# Altium schematic sheet Schematic.SchDoc
size A3; SheetNumber: 1; SheetTotal: 2
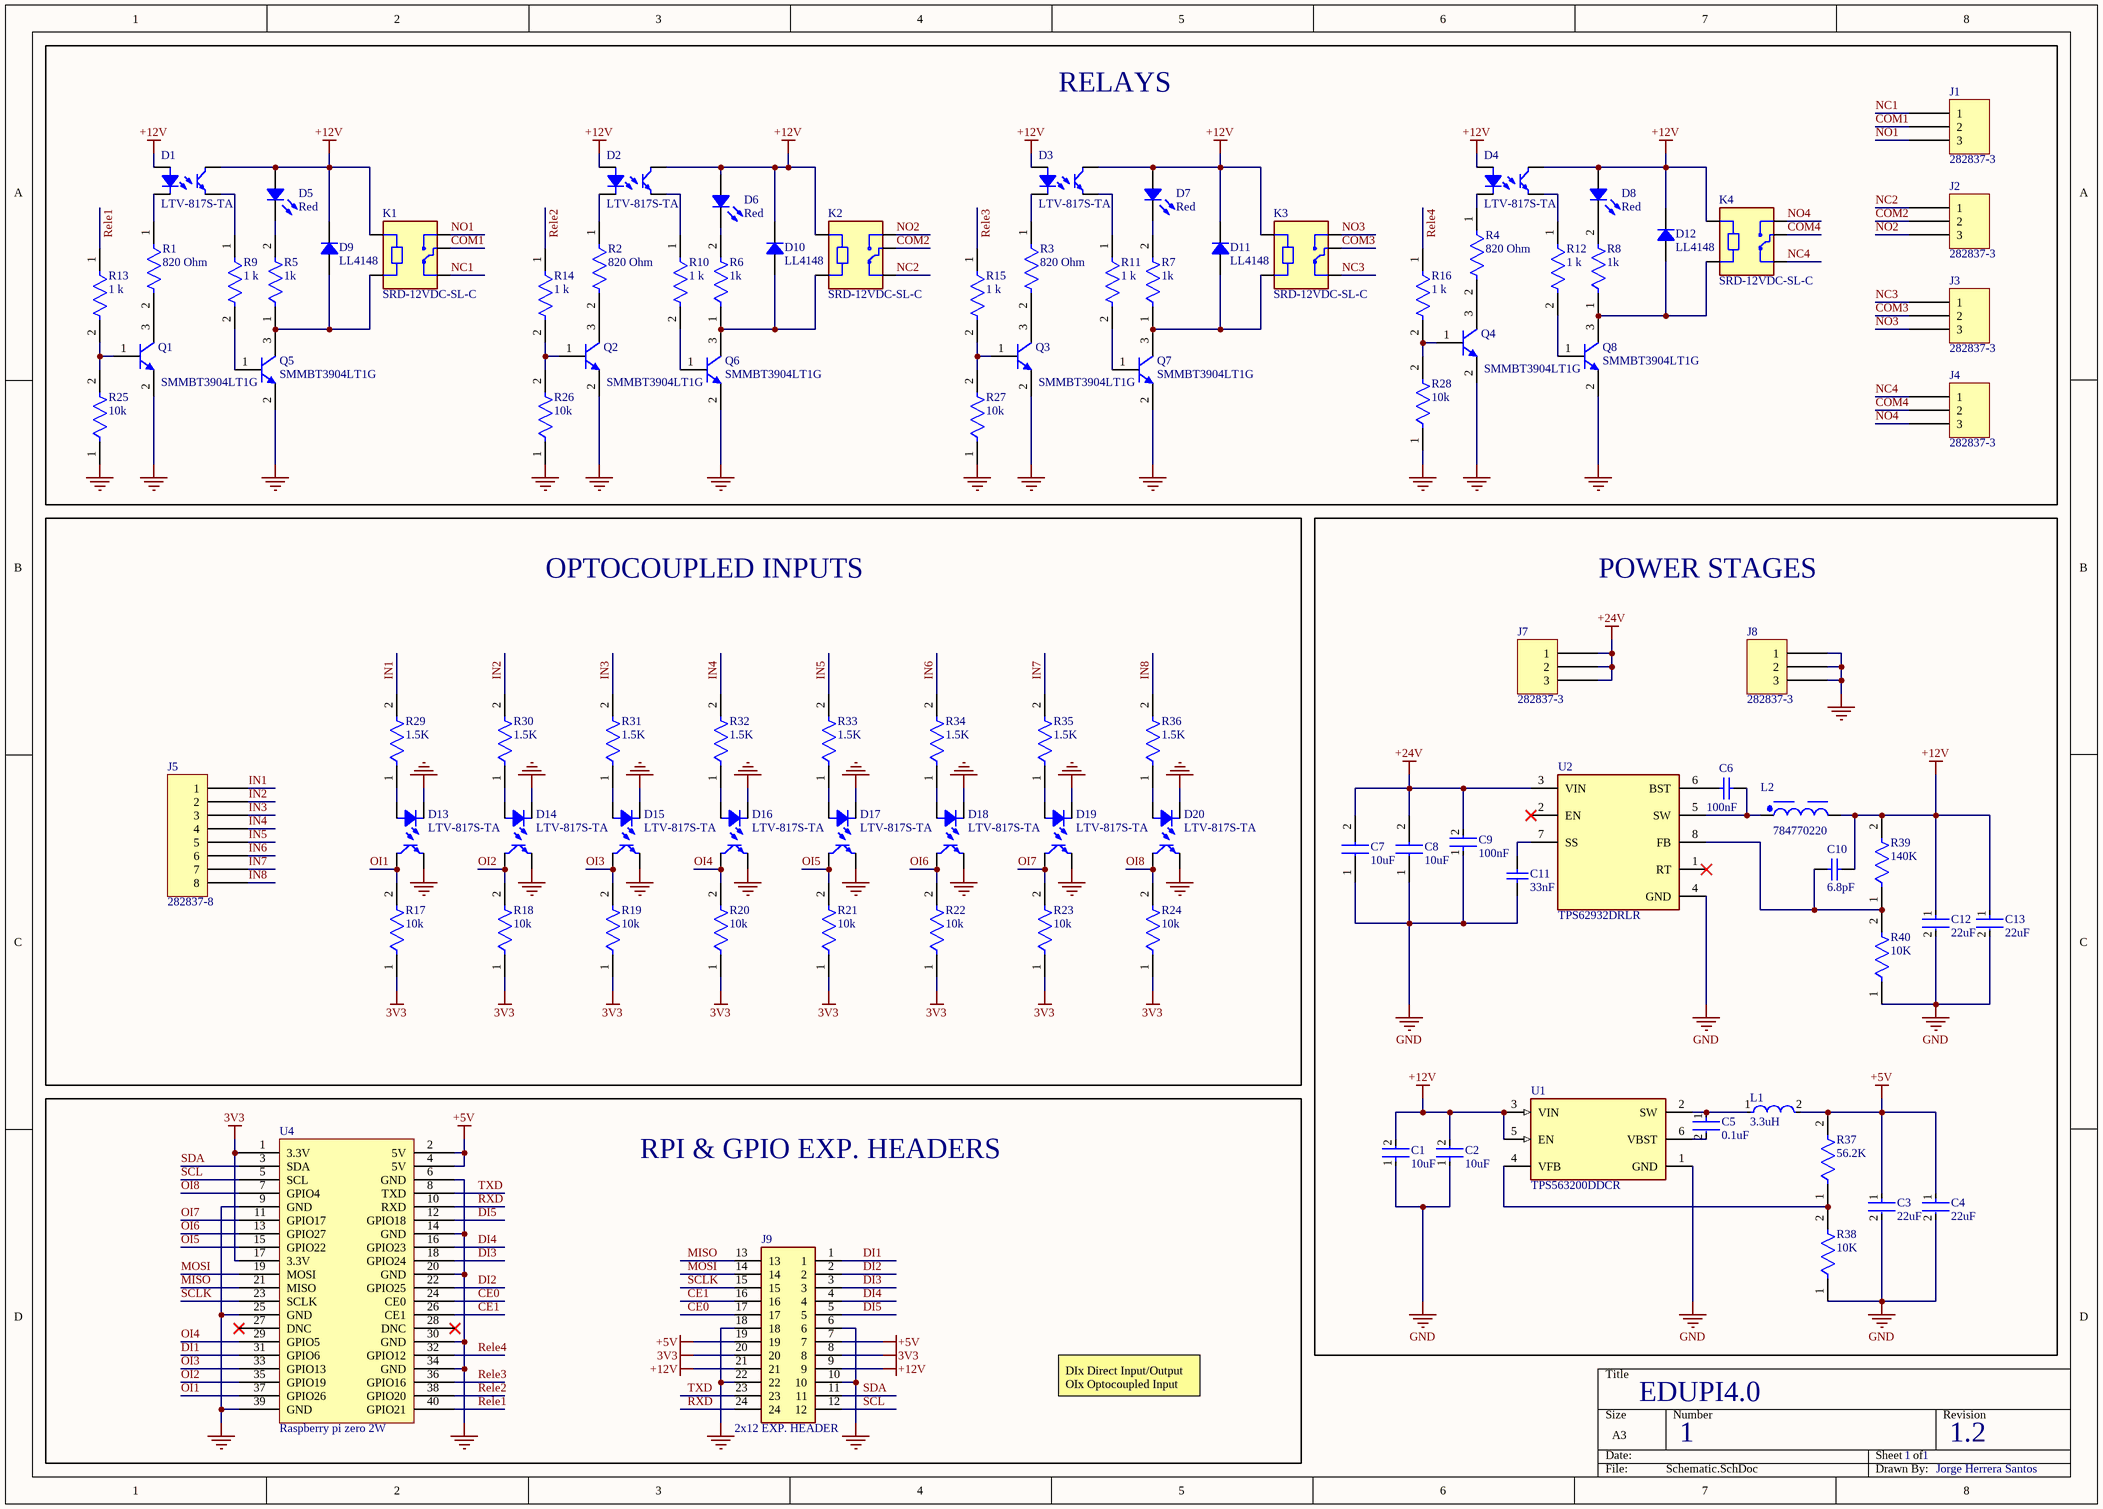
[diagram p0: Schematic.SchDoc]

## Parts
C1  10uF  [FP-GRM21B-0_15-IPC_C]
C2  10uF  [FP-GRM21B-0_15-IPC_C]
C3  22uF  [FP-GRM21B-0_2-e0_2_0_7-IPC_C]
C4  22uF  [FP-GRM21B-0_2-e0_2_0_7-IPC_C]
C5  0.1uF  [FP-CC0805-0_85-MFG]
C6  100nF  [CAPC1005X55X25LL05T10]
C7  10uF  [CAPC3225X270N]
C8  10uF  [CAPC3225X270N]
C9  100nF  [FP-CGA3E-0_3-0_1-IPC_A]
C10  6.8pF  [CAPC1005X55X25NL05T10]
C11  33nF  [CAPC1005X55X25NL05T10]
C12  22uF  [FP-C3216-160-0_2-IPC_B]
C13  22uF  [FP-C3216-160-0_2-IPC_B]
D1  LTV-817S-TA  [LITEON LTV-817]
D2  LTV-817S-TA  [LITEON LTV-817]
D3  LTV-817S-TA  [LITEON LTV-817]
D4  LTV-817S-TA  [LITEON LTV-817]
D5  Red  [LED 1206_3216 RED]
D6  Red  [LED 1206_3216 RED]
D7  Red  [LED 1206_3216 RED]
D8  Red  [LED 1206_3216 RED]
D9  LL4148  [SOD-80 MiniMELF]
D10  LL4148  [SOD-80 MiniMELF]
D11  LL4148  [SOD-80 MiniMELF]
D12  LL4148  [SOD-80 MiniMELF]
D13  LTV-817S-TA  [LITEON LTV-817]
D14  LTV-817S-TA  [LITEON LTV-817]
D15  LTV-817S-TA  [LITEON LTV-817]
D16  LTV-817S-TA  [LITEON LTV-817]
D17  LTV-817S-TA  [LITEON LTV-817]
D18  LTV-817S-TA  [LITEON LTV-817]
D19  LTV-817S-TA  [LITEON LTV-817]
D20  LTV-817S-TA  [LITEON LTV-817]
J1  282837-3  [TE 282837-3]
J2  282837-3  [TE 282837-3]
J3  282837-3  [TE 282837-3]
J4  282837-3  [TE 282837-3]
J5  282837-8  [TE 282837-8]
J7  282837-3  [TE 282837-3]
J8  282837-3  [TE 282837-3]
J9  2x12 EXP. HEADER  [2x12 MALE HEADER]
K1  SRD-12VDC-SL-C  [RELAY_SRD-05VDC-SL-C]
K2  SRD-12VDC-SL-C  [RELAY_SRD-05VDC-SL-C]
K3  SRD-12VDC-SL-C  [RELAY_SRD-05VDC-SL-C]
K4  SRD-12VDC-SL-C  [RELAY_SRD-05VDC-SL-C]
L1  3.3uH  [FP-NR8040-H_4_2-MFG]
L2  784770220  [WE-PDA_1280]
Q1  SMMBT3904LT1G  [ONSC-SOT-23-3-318-08_V]
Q2  SMMBT3904LT1G  [ONSC-SOT-23-3-318-08_V]
Q3  SMMBT3904LT1G  [ONSC-SOT-23-3-318-08_V]
Q4  SMMBT3904LT1G  [ONSC-SOT-23-3-318-08_V]
Q5  SMMBT3904LT1G  [ONSC-SOT-23-3-318-08_V]
Q6  SMMBT3904LT1G  [ONSC-SOT-23-3-318-08_V]
Q7  SMMBT3904LT1G  [ONSC-SOT-23-3-318-08_V]
Q8  SMMBT3904LT1G  [ONSC-SOT-23-3-318-08_V]
R1  820 Ohm  [FP-CRCW0603-HPe3-MFG]
R2  820 Ohm  [FP-CRCW0603-HPe3-MFG]
R3  820 Ohm  [FP-CRCW0603-HPe3-MFG]
R4  820 Ohm  [FP-CRCW0603-HPe3-MFG]
R5  1k  [FP-CRCW0603-HPe3-MFG]
R6  1k  [FP-CRCW0603-HPe3-MFG]
R7  1k  [FP-CRCW0603-HPe3-MFG]
R8  1k  [FP-CRCW0603-HPe3-MFG]
R9  1 k  [FP-MCT0603-IPC_C]
R10  1 k  [FP-MCT0603-IPC_C]
R11  1 k  [FP-MCT0603-IPC_C]
R12  1 k  [FP-MCT0603-IPC_C]
R13  1 k  [FP-MCT0603-IPC_C]
R14  1 k  [FP-MCT0603-IPC_C]
R15  1 k  [FP-MCT0603-IPC_C]
R16  1 k  [FP-MCT0603-IPC_C]
R17  10k  [FP-MCT0603-IPC_B]
R18  10k  [FP-MCT0603-IPC_B]
R19  10k  [FP-MCT0603-IPC_B]
R20  10k  [FP-MCT0603-IPC_B]
R21  10k  [FP-MCT0603-IPC_B]
R22  10k  [FP-MCT0603-IPC_B]
R23  10k  [FP-MCT0603-IPC_B]
R24  10k  [FP-MCT0603-IPC_B]
R25  10k  [FP-MCT0603-IPC_B]
R26  10k  [FP-MCT0603-IPC_B]
R27  10k  [FP-MCT0603-IPC_B]
R28  10k  [FP-MCT0603-IPC_B]
R29  1.5K  [FP-CRCW0603-e3-IPC_C]
R30  1.5K  [FP-CRCW0603-e3-IPC_C]
R31  1.5K  [FP-CRCW0603-e3-IPC_C]
R32  1.5K  [FP-CRCW0603-e3-IPC_C]
R33  1.5K  [FP-CRCW0603-e3-IPC_C]
R34  1.5K  [FP-CRCW0603-e3-IPC_C]
R35  1.5K  [FP-CRCW0603-e3-IPC_C]
R36  1.5K  [FP-CRCW0603-e3-IPC_C]
R37  56.2K  [FP-MCT0603-IPC_B]
R38  10K  [FP-MCT0603-IPC_C]
R39  140K  [FP-CRCW0603-HPe3-IPC_C]
R40  10K  [FP-MCT0603-IPC_C]
U1  TPS563200DDCR  [FP-DDC0006A-MFG]
U2  TPS62932DRLR  [FP-DRL0008A-MFG]
U4  Raspberry pi zero 2W  [Raspberry Pi Zero 2 W]

## Blocks framed on the sheet
RELAYS: D1-D12 J1-J4 K1-K4 Q1-Q8 R1-R16 R25-R28
OPTOCOUPLED INPUTS: D13-D20 J5 R17-R24 R29-R36
POWER STAGES: C1-C13 J7 J8 L1 L2 R37-R40 U1 U2
RPI & GPIO EXP. HEADERS: J9 U4

## Nets
3V3: J9.8 J9.20 R17.1 R18.1 R19.1 R20.1 R21.1 R22.1 R23.1 R24.1 U4.1(3.3V) U4.17(3.3V)
+5V: C3.1 C4.1 J9.7 J9.19 L1.2 R37.2 U4.2(5V) U4.4(5V)
+12V: C1.2 C2.2 C10.2 C12.1 C13.1 D1.1 D1.4 D2.1 D2.4 D3.1 D3.4 D4.1 D4.4 D5.1 D6.1 D7.1 D8.1 D9.2 D10.2 D11.2 D12.2 J9.9 J9.21 K1.A1 K2.A1 K3.A1 K4.A1 L2.2 R39.2 U1.3(VIN) U1.5(EN)
+24V: C7.2 C8.2 C9.2 J7.1 J7.2 J7.3 U2.3(VIN)
GND: C1.1 C2.1 C3.2 C4.2 C7.1 C8.1 C9.1 C11.1 C12.2 C13.2 D13.2 D13.3 D14.2 D14.3 D15.2 D15.3 D16.2 D16.3 D17.2 D17.3 D18.2 D18.3 D19.2 D19.3 D20.2 D20.3 J8.1 J8.2 J8.3 J9.6 J9.10 J9.18 J9.22 Q1.2(E) Q2.2(E) Q3.2(E) Q4.2(E) Q5.2(E) Q6.2(E) Q7.2(E) Q8.2(E) R25.1 R26.1 R27.1 R28.1 R38.1 R40.1 U1.1(GND) U2.4(GND) U4.6(GND) U4.9(GND) U4.14(GND) U4.20(GND) U4.25(GND) U4.30(GND) U4.34(GND) U4.39(GND)
CE0: J9.17 U4.24(CE0)
CE1: J9.16 U4.26(CE1)
COM1: J1.2 K1.COM
COM2: J2.2 K2.COM
COM3: J3.2 K3.COM
COM4: J4.2 K4.COM
DI1: J9.1 U4.31(GPIO6)
DI2: J9.2 U4.22(GPIO25)
DI3: J9.3 U4.18(GPIO24)
DI4: J9.4 U4.16(GPIO23)
DI5: J9.5 U4.12(GPIO18)
IN1: J5.1 R29.2
IN2: J5.2 R30.2
IN3: J5.3 R31.2
IN4: J5.4 R32.2
IN5: J5.5 R33.2
IN6: J5.6 R34.2
IN7: J5.7 R35.2
IN8: J5.8 R36.2
MISO: J9.13 U4.21(MISO)
MOSI: J9.14 U4.19(MOSI)
NC1: J1.1 K1.NC
NC2: J2.1 K2.NC
NC3: J3.1 K3.NC
NC4: J4.1 K4.NC
NO1: J1.3 K1.NO
NO2: J2.3 K2.NO
NO3: J3.3 K3.NO
NO4: J4.3 K4.NO
OI1: D13.4 R17.2 U4.37(GPIO26)
OI2: D14.4 R18.2 U4.35(GPIO19)
OI3: D15.4 R19.2 U4.33(GPIO13)
OI4: D16.4 R20.2 U4.29(GPIO5)
OI5: D17.4 R21.2 U4.15(GPIO22)
OI6: D18.4 R22.2 U4.13(GPIO27)
OI7: D19.4 R23.2 U4.11(GPIO17)
OI8: D20.4 R24.2 U4.7(GPIO4)
Rele1: R13.1 U4.40(GPIO21)
Rele2: R14.1 U4.38(GPIO20)
Rele3: R15.1 U4.36(GPIO16)
Rele4: R16.1 U4.32(GPIO12)
RXD: J9.24 U4.10(RXD)
SCL: J9.12 U4.5(SCL)
SCLK: J9.15 U4.23(SCLK)
SDA: J9.11 U4.3(SDA)
TXD: J9.23 U4.8(TXD)
NetC5_1: C5.1 L1.1 U1.2(SW)
NetC5_2: C5.2 U1.6(VBST)
NetC6_1: C6.1 U2.6(BST)
NetC6_2: C6.2 L2.1 U2.5(SW)
NetC10_1: C10.1 R39.1 R40.2 U2.8(FB)
NetC11_2: C11.2 U2.7(SS)
NetD1_2: D1.2 R1.1
NetD1_3: D1.3 R9.1
NetD2_2: D2.2 R2.1
NetD2_3: D2.3 R10.1
NetD3_2: D3.2 R3.1
NetD3_3: D3.3 R11.1
NetD4_2: D4.2 R4.1
NetD4_3: D4.3 R12.1
NetD5_2: D5.2 R5.2
NetD6_2: D6.2 R6.2
NetD7_2: D7.2 R7.2
NetD8_2: D8.2 R8.2
NetD9_1: D9.1 K1.A2 Q5.3(C) R5.1
NetD10_1: D10.1 K2.A2 Q6.3(C) R6.1
NetD11_1: D11.1 K3.A2 Q7.3(C) R7.1
NetD12_1: D12.1 K4.A2 Q8.3(C) R8.1
NetD13_1: D13.1 R29.1
NetD14_1: D14.1 R30.1
NetD15_1: D15.1 R31.1
NetD16_1: D16.1 R32.1
NetD17_1: D17.1 R33.1
NetD18_1: D18.1 R34.1
NetD19_1: D19.1 R35.1
NetD20_1: D20.1 R36.1
NetQ1_1: Q1.1(B) R13.2 R25.2
NetQ1_3: Q1.3(C) R1.2
NetQ2_1: Q2.1(B) R14.2 R26.2
NetQ2_3: Q2.3(C) R2.2
NetQ3_1: Q3.1(B) R15.2 R27.2
NetQ3_3: Q3.3(C) R3.2
NetQ4_1: Q4.1(B) R16.2 R28.2
NetQ4_3: Q4.3(C) R4.2
NetQ5_1: Q5.1(B) R9.2
NetQ6_1: Q6.1(B) R10.2
NetQ7_1: Q7.1(B) R11.2
NetQ8_1: Q8.1(B) R12.2
NetR37_1: R37.1 R38.2 U1.4(VFB)

Not connected (* = marked no-connect by the designer): U2 1(RT)* 2(EN)*; U4 27(DNC)* 28(DNC)*

## Notes on the sheet
- DIx Direct Input/Output
  OIx Optocoupled Input
- EDUPI4.0
- 1
- 1    1
- 1.2
- Jorge Herrera Santos

## Library data of the parts
C1 C2 = CMP-2007-03541-2: Chip Multilayer Ceramic Capacitors for General Purpose, 0805, 10uF, X5R, 15%, 10%, 25V; Length: 2mm; Depth: 1.25mm; Termination: SMD/SMT; Voltage: 25V; Height: 1.25mm; Material: Ceramic; Thickness: 0.053inch; Radiation Hardening: No; Min Operating Temperature: -55°C; Width: 0.049inch; Package Quantity: 1; Mount: Surface Mount; Dielectric: X5R; Packaging: Tape and Reel; Capacitance: 10uF; Voltage Rating (DC): 25V; Lead Free: Lead Free; Max Operating Temperature: 85°C; Case Code (Imperial): 0805; Case/Package: 0805; Tolerance: 10%; Voltage Rating: 25V; Case Code (Metric): 2012
C3 C4 = CMP-06035-039918-1: Chip Multilayer Ceramic Capacitors for General Purpose, 0805, 22uF, X5R, 15%, 20%, 10V; Dissipation Factor: 0.035%; Min Operating Temperature: -55°C; Voltage Rating (DC): 10V; Height: 1.25mm; Depth: 1.25mm; Max Operating Temperature: 85°C; Width: 1.25mm; Lead Free: Lead Free; Dielectric Material: Ceramic; Weight: 0.000335oz; Tolerance: 20%; Voltage Rating: 10V; Case Code (Metric): 2012; Termination: SMD/SMT; Length: 2mm; Thickness: 0.057inch; Case/Package: 0805; Packaging: Tape and Reel; Voltage: 10V; Case Code (Imperial): 0805; Resistor Type: Ceramic; Package Quantity: 3000; Mount: Surface Mount; Capacitance: 22uF; Dielectric: X5R
C5 = CMP-1036-04410-2: CAP CER 0.1UF 25V X7R 0805; Manufacturer Part Number: CC0805KRX7R8BB104; Manufacturer: Yageo; Tolerance: 0.1; Material: Ceramic; Value: 100 nF; ComponentLink2URL: http://www.yageo.com/documents/recent/UPY-GPHC_Y5V_6.3V-to-50V_8.pdf; Category: Cap; Mouser Description: Multilayer Ceramic Capacitors MLCC - SMD/SMT 100nF 25V X7R 10%; Device Class L1: Passive Components; Footprint Url: http://www.yageo.com/exep/pages/download/literatures/UPY-C_GEN_24.pdf; Height: 0.95mm; Digikey Description: CAP CER 0.1UF 25V X7R 0805; Lead Free: Yes; Temperature Range High: +85°C; Temperature: -30°C to +85°C; Ipc Land Pattern Name: CAPC200125X85; Capacitance: 100 nF; Automotive: No; Octopart: https://octopart.com/cc0805krx7r8bb104-yageo-39467766; Device Class L2: Capacitors; Temperature Characteristic: X7R; Voltage Rating: 25 V; ComponentLink2Description: Datasheet; Temperature Range Low: -30°C; Device Class L3: Ceramic Capacitors; RoHS: TRUE; Package: CC0805-0.85
C6 = CMP-2000-06331-1: Chip Capacitor, 0.1 uF, +/- 10%, 10 V, -55 to 125 degC, 0402 (1005 Metric), RoHS, Tape and Reel; Manufacturer: Murata; Rated Voltage: 10V; Capacitance: 100000pF; Dielectric: X7R; Manufacturer URL: http://www.murata.com/; Datasheet Version: 02/2016; Datasheet URL: http://search.murata.co.jp/Ceramy/image/img/A01X/G101/ENG/GRM155R71A104KA01-01.pdf; Package Reference: 0402; Tolerance (%): ±10%; Package Description: 2-Pin Surface Mount Device, Body 1 x 0.5 mm; Mounting Technology: SurfaceMount; Case Size/Dimension: 0402
C7 C8 = MSASU32MSB5106KPNA01: Capacitor; Manufacturer_Name: TAIYO YUDEN; Datasheet Link: https://4donline.ihs.com/images/VipMasterIC/IC/TAIY/TAIY-S-A0018972909/TAIY-S-A0018972909-1.pdf?hkey=61A2E4C270F0397D049F8F05BD4F1054; Height: 2.7mm; Manufacturer_Part_Number: MSASU32MSB5106KPNA01
C9 = CMP-2000-07546-2: Cap Ceramic 100nF 50V X7R 10% Pad SMD 0603 +125°C Automotive T/R; Weight: 7.1E-05oz; Composition: Ceramic; Max Operating Temperature: 125°C; Termination: SMD/SMT; Dielectric: X7R; Length: 1.6mm; Package Quantity: 1; REACH SVHC: No SVHC; Lead Free: Lead Free; Case Code (Metric): 1608; Min Operating Temperature: -55°C; Packaging: Tape and Reel; Tolerance: 10%; Voltage Rating: 50V; Case Code (Imperial): 0603; Capacitance: 100nF; Case/Package: 0603; Voltage Rating (DC): 50V; Depth: 0.8mm; Radiation Hardening: No; Ratings: AEC-Q200; Mount: Surface Mount; Voltage: 50V; Thickness: 0.035inch; Width: 0.8mm; Height: 0.8mm
C10 = CMP-2008-04219-1: Part Number: GRM1555C1E6R8CA01D; Manufacturer: Murata
C11 = CMP-2008-04594-1: Part Number: GRM155R71A333KA01D; Manufacturer: Murata
C12 C13 = CMP-2000-05398-2: Multilayer Ceramic Capacitors 22uF ±20% 35V X5R SMD 1206; Mount: Surface Mount; Voltage Rating: 35V; Length: 3.2mm; Case/Package: 1206; Width: 0.063inch; Dielectric Material: Ceramic; Series: C; Voltage Rating (DC): 35V; Construction: Flat; Tolerance: 20%; Dielectric: X5R; Voltage: 35V; Min Operating Temperature: -55°C; Case Code (Metric): 3216; Termination: SMD/SMT; Capacitance: 22uF; Resistor Type: Ceramic; RoHS Compliant: Yes; Height: 1.6mm; Depth: 1.6mm; Radiation Hardening: No; Package Quantity: 2000; REACH SVHC: No SVHC; Case Code (Imperial): 1206; Weight: 0.000571oz; Max Operating Temperature: 85°C; Packaging: Tape and Reel; Thickness: 1.6mm; Lead Free: Lead Free
D1-D4 D13-D20 = LTV-817S-TA: OPTOISOLATR 5KV TRANSISTOR 4-SMD; Manufacturer: Lite-On Inc.; Current - DC Forward (If) (Max): 50mA; Current Transfer Ratio (Max): 600% @ 5mA; Current Transfer Ratio (Min): 50% @ 5mA; Input Type: DC; Number of Channels: 1; Rise / Fall Time (Typ): 4µs, 3µs; Vce Saturation (Max): 200mV; Voltage - Forward (Vf) (Typ): 1.2V; Voltage - Isolation: 5000Vrms; Voltage - Output (Max): 35V; Part Number: LTV-817S-TA; ComponentLink1Description: Datasheet; ComponentLink1URL: http://optoelectronics.liteon.com/upload/download/DS-70-96-0016/LTV-8X7%20series%20201610%20.pdf; ComponentLink2Description: DigiKey Link; ComponentLink2URL: http://digikey.com/product-detail/en/lite-on-inc/LTV-817S-TA/160-2038-1-ND/3711420; Current - Output / Channel: 50mA; Device Package: 4-SMD, Gull Wing; LastUpdated: 12/01/2020 21:59:02; Lifecycle Status: Active; Minimum Order: 1; Mounting Type: Surface Mount; Operating Temperature: -30°C ~ 110°C; Output Type: Transistor; Package / Case: 4-SMD, Gull Wing; Packaging: TapeAndReel; Part Status: Active; Price: 0.12; Series: -; Supplier 1: DigiKey; Supplier Part Number 1: 160-2038-1-ND; Supplier Device Package: 4-SMD
D5-D8 = LTST-C150KAKT: LED RED CLEAR SMD; Manufacturer: Lite-On Inc.; Configuration: Standard; Current - Test: 20mA; Lens Color: Colorless; Lens Size: 2.06mm x 1.60mm; Lens Style: Rectangle with Flat Top; Millicandela Rating: 55mcd; Viewing Angle: 130°; Voltage - Forward (Vf) (Typ): 2V; Wavelength - Dominant: 615nm; Wavelength - Peak: 621nm; Part Number: LTST-C150KAKT; Color: Red; ComponentLink1Description: Datasheet; ComponentLink1URL: //media.digikey.com/pdf/Data%20Sheets/Lite-On%20PDFs/LTST-C150KAKT.pdf; ComponentLink2Description: DigiKey Link; ComponentLink2URL: http://digikey.com/product-detail/en/lite-on-inc/LTST-C150KAKT/160-1402-1-ND/386755; Device Package: 1206 (3216 Metric); Height (Max): 1.10mm; LastUpdated: 03/06/2024 20:00:41; Lens Transparency: Clear; Lifecycle Status: Active; Minimum Order: 1; Mounting Type: Surface Mount; Package / Case: 1206 (3216 Metric); Packaging: TapeAndReel; PartId: 189; Part Status: Active; Price: 0.07; Series: -; Size / Dimension: 3.20mm L x 1.60mm W; Supplier 1: DigiKey; Supplier Part Number 1: 160-1402-1-ND; Value: Red
D9-D12 = LL4148: DIODE GEN PURP 100V 200MA SOD80; Manufacturer: ON Semiconductor; Current - Reverse Leakage @ Vr: 25nA @ 20V; Diode Type: Standard; Reverse Recovery Time (trr): 4ns; Speed: Small Signal =< 200mA (Io), Any Speed; Voltage - Forward (Vf) (Max) @ If: 1V @ 10mA; Part Number: LL4148; ComponentLink1Description: Datasheet; ComponentLink1URL: https://www.onsemi.com/pub/Collateral/LL4148-D.pdf; ComponentLink2Description: DigiKey Link; ComponentLink2URL: http://digikey.com/product-detail/en/on-semiconductor/LL4148/LL4148FSCT-ND/1923118; Current - Average Rectified (Io): 200mA; LastUpdated: 03/06/2024 20:05:39; Lifecycle Status: Active; Minimum Order: 1; Mounting Type: Surface Mount; Operating Temperature - Junction: -55°C ~ 175°C; Package / Case: DO-213AC, MINI-MELF, SOD-80; Packaging: TapeAndReel; PartId: 2621; Part Status: Active; Price: 0.02; Series: -; Supplier 1: DigiKey; Supplier Part Number 1: LL4148FSCT-ND; Supplier Device Package: SOD-80; Voltage - DC Reverse (Vr) (Max): 100V
J1-J4 J7 J8 = 282837-3: TERM BLK 3P SIDE ENT 5.08MM PCB; Manufacturer: TE Connectivity AMP Connectors; Current: 13.5 A; Mating Orientation: Horizontal with Board; Number of Levels: 1; Pitch: 0.200" (5.08mm); Positions Per Level: 3; Voltage: 300 V; Wire Gauge: 16-28 AWG; Wire Termination: Screw - Rising Cage Clamp; Part Number: 282837-3; Color: Green; ComponentLink1Description: Datasheet; ComponentLink1URL: https://www.te.com/commerce/DocumentDelivery/DDEController?Action=srchrtrv&DocNm=282837&DocType=Customer+Drawing&DocLang=English; ComponentLink2Description: DigiKey Link; ComponentLink2URL: https://www.digikey.com/en/products/detail/te-connectivity-amp-connectors/282837-3/2187974; Features: Interlocking (Side); LastUpdated: 21/06/2022 15:00:39; Lifecycle Status: Active; Minimum Order: 1; Mounting Type: Through Hole; Packaging: Tray; Part Status: Active; Price: 0.47; Series: Buchanan; Supplier 1: DigiKey; Supplier Part Number 1: A113321-ND
J5 = 282837-8: TERM BLK 8P SIDE ENT 5.08MM PCB; Manufacturer: TE Connectivity AMP Connectors; Current: 13.5 A; Mating Orientation: Horizontal with Board; Number of Levels: 1; Pitch: 0.200" (5.08mm); Positions Per Level: 8; Voltage: 300 V; Wire Gauge: 16-28 AWG; Wire Termination: Screw - Rising Cage Clamp; Part Number: 282837-8; Color: Green; ComponentLink1Description: Datasheet; ComponentLink1URL: https://www.te.com/commerce/DocumentDelivery/DDEController?Action=srchrtrv&DocNm=282837&DocType=Customer+Drawing&DocLang=English; ComponentLink2Description: DigiKey Link; ComponentLink2URL: https://www.digikey.com/en/products/detail/te-connectivity-amp-connectors/282837-8/2222331; Features: Interlocking (Side); LastUpdated: 21/06/2022 15:01:52; Lifecycle Status: Active; Minimum Order: 1; Mounting Type: Through Hole; Packaging: Bulk; Part Status: Active; Price: 1.64; Series: Buchanan; Supplier 1: DigiKey; Supplier Part Number 1: 282837-8-ND
J9 = 2X12 MALE HEADER_1: Conn Unshrouded Header HDR 20 POS 2.54mm Solder ST Thru-Hole Box; MF: TE Connectivity; MP: 1-826656-0; Purchase-URL: https://pricing.snapeda.com/search/part/1-826656-0/?ref=eda; Value: *; SnapEDA_Link: https://www.snapeda.com/parts/1-826656-0/TE%20Connectivity%20AMP%20Connectors/view-part/2881856/?ref=snap; Package: None; Availability: Good; Price: None; Check_prices: https://www.snapeda.com/parts/1-826656-0/TE%20Connectivity%20AMP%20Connectors/view-part/2881856/?ref=eda
K1-K4 = SRD-05VDC-SL-C: 5V Trigger Relay Module For Arduino And Raspberry Pi 5V Trigger Relay Module For Arduino And Raspberry Pi; MF: Songle Relay; Check_prices: https://www.snapeda.com/parts/SRD-05VDC-SL-C/Songle+Relay/view-part/?ref=eda; Value: *; Availability: Not in stock; Price: None; Package: NON STANDARD-5 Songle Relay; MP: SRD-05VDC-SL-C; SnapEDA_Link: https://www.snapeda.com/parts/SRD-05VDC-SL-C/Songle+Relay/view-part/?ref=snap
L1 = CMP-14484-000667-1: Shielded Wirewound Inductor 3.3uH 30% 6A 19.5mΩ SMD NRS8040T3R3NJGJ; RoHS Compliant: Yes
L2 = CMP-03913-56466835-3: Power Inductor, 22Uh, Shielded, 4A Rohs Compliant: Yes; DC Resistance (DCR): 44.5mΩ; Saturation Current: 4.7A; Self Resonant Frequency: 15.6MHz; Inductance: 22µH; Tolerance: 20%; Core Material: Ferrite; Test Frequency: 100kHz; Shielding: Shielded; Case/Package: Nonstandard; Width: 11.9888mm; Max Operating Temperature: 125°C; Min Operating Temperature: -40°C; Height - Seated (Max): 8.3058mm; Current Rating: 4A; Ratings: AEC-Q200; Composition: Wirewound; Mount: Surface Mount; RoHS: Compliant; Length: 11.9888mm
Q1-Q8 = CMP-1048-00625-1: General Purpose Transistor, NPN Silicon, 3-Pin SOT-23, Pb-Free, Tape and Reel; Manufacturer: On Semiconductor; IC Continuous (A): 0.2; fT Min (MHz): 300; PackageDescription: 3-Pin Small Outline Transistor, Body 2.92 x 1.3 mm, Pitch 0.95 mm; Mounting Technology: Surface Mount; ComponentLink1Description: Manufacturer URL; DatasheetVersion: Rev. 12; PackageReference: SOT-23-3-318-08; ComponentLink1URL: http://www.onsemi.com/; ComponentLink3Description: Package Specification; RoHS: TRUE; PartNumber: SMMBT3904LT1G; Polarity: NPN; Packing: Tape and Reel; ComponentLink2URL: http://www.onsemi.cn/pub_link/Collateral/MMBT3904LT1-D.PDF; PackageVersion: Rev. AP, 11/2009; ComponentLink2Description: Datasheet; ComponentLink3URL: http://www.onsemi.cn/pub_link/Collateral/318-08.PDF
R1-R8 = CMP-02407-003128-1: RES Thick Film, 820Ω, 1%, 0.33W, 100ppm/°C, 0603; Voltage Rating: 75V; Max Power Dissipation: 250mW; Resistance: 820R; Temperature Coefficient: 100ppm/°C; Termination: SMD/SMT; Military Standard: Not; Features: Automotive AEC-Q200; Composition: Thick Film; Voltage Rating (DC): 75V; Contact Plating: Tin; Package Quantity: 1; Case Code (Metric): 1608; Width: 0.033inch; Case/Package: 0603; Packaging: Tape and Reel; Depth: 0.85mm; Lead Free: Lead Free; Tolerance: 1%; Length: 1.6mm; Power Rating: 250mW; Weight: 7.1E-05oz; Case Code (Imperial): 0603; Radiation Hardening: No; Number of Terminations: 2; Max Operating Temperature: 155°C; Height: 0.45mm; Min Operating Temperature: -55°C
R9-R16 = CMP-02407-000265-1: MCT0603PD1001DP500 RES SMD 100 OHM 1% 1/8W 0603; Resistance: 1kR; Temperature Coefficient: 25ppm/°C; Tolerance: 0.5%; Max Power Dissipation: 250mW; Case Code (Metric): 1608; Case Code (Imperial): 0603; Number of Terminations: 2; Case/Package: 0603; Features: Automotive AEC-Q200; Max Operating Temperature: 175°C; Min Operating Temperature: -55°C; Composition: Thin Film; Packaging: Tape and Reel
R17-R28 = CMP-02407-000530-1: MCT0603MD1002BP100 RES SMD 10k OHM 1% 1/8W 0603; Resistance: 10kR; Voltage Rating (DC): 75V; Max Power Dissipation: 125mW; Tolerance: 0.1%; Temperature Coefficient: 25ppm/°C; Max Operating Temperature: 155°C; Case/Package: 0603; Contact Plating: Tin; Military Standard: Not; Number of Terminations: 2; Min Operating Temperature: -55°C; Radiation Hardening: No; Lead Free: Lead Free; Case Code (Imperial): 0603; Length: 1.55mm; Voltage Rating: 75V; Height: 0.45mm; Features: Automotive AEC-Q200; Case Code (Metric): 1608; REACH SVHC: No SVHC; Packaging: Tape and Reel; Depth: 0.85mm; Width: 0.033inch; Package Quantity: 1; Composition: Thin Film; Power Rating: 125mW
R29-R36 = CMP-02407-004713-1: CRCW06031K50FKEC RES Thick Film, 1.5kΩ, 1%, 0.1W, 100ppm/°C, 0603; Resistance: 1.5kR; Max Power Dissipation: 100mW; Military Standard: Not; Packaging: Tape and Reel; Min Operating Temperature: -55°C; Composition: Thick Film; Features: Automotive AEC-Q200; Width: 0.033inch; Package Quantity: 20000; Depth: 0.85mm; Max Operating Temperature: 155°C; Case/Package: 0603; Height: 0.02inch; Number of Terminations: 2; Lead Free: Lead Free; Tolerance: 1%; Length: 0.061inch; Temperature Coefficient: 100ppm/°C
R37 = CMP-02407-010240-1: RES SMD 100 OHM 1% 1/8W 0603; Voltage Rating: 75V; Temperature Coefficient: 50ppm/°C; Max Power Dissipation: 125mW; Power Rating: 100mW; Resistance: 56.2kR; Depth: 0.85mm; Min Operating Temperature: -55°C; Lead Free: Lead Free; Case Code (Imperial): 0603; Width: 0.033inch; Radiation Hardening: No; Max Operating Temperature: 125°C; Package Quantity: 5000; Number of Terminations: 2; Case/Package: 0603; Case Code (Metric): 1608; Height: 0.022inch; Military Standard: Not; Length: 0.061inch; Packaging: Tape and Reel; Composition: Thin Film; Contact Plating: Tin; Mount: Surface Mount; Tolerance: 1%; Voltage Rating (DC): 75V
R38 = CMP-02407-000418-1: RES SMD 10K OHM 1% 1/8W 0603; Voltage Rating: 75V; Power Rating: 100mW; Temperature Coefficient: 50ppm/°C; Max Power Dissipation: 125mW; Resistance: 10kR; Case/Package: 0603; Military Standard: Not; Min Operating Temperature: -55°C; Width: 0.8mm; Package Quantity: 1; Max Operating Temperature: 125°C; Tolerance: 1%; Depth: 0.85mm; Radiation Hardening: No; Mount: Surface Mount; Composition: Thin Film; Contact Plating: Tin; Lead Free: Lead Free; Case Code (Imperial): 0603; Number of Terminations: 2; Voltage Rating (DC): 75V; Length: 1.55mm; Packaging: Tape and Reel; Height: 0.022inch; Case Code (Metric): 1608
R39 = CMP-02407-004908-1: RES Thick Film, 140kΩ, 1%, 0.33W, 100ppm/°C, 0603; Resistance: 140kR; Max Power Dissipation: 250mW; Case/Package: 0603; Tolerance: 1%; Temperature Coefficient: 100ppm/°C; Lead Free: Lead Free; Height: 0.022inch; Max Operating Temperature: 155°C; Length: 0.063inch; Width: 0.033inch; Number of Terminations: 2; Packaging: Tape and Reel; Composition: Thick Film; Min Operating Temperature: -55°C; Features: Automotive AEC-Q200; Package Quantity: 5000
R40 = CMP-02407-000418-1: RES SMD 10K OHM 1% 1/5W 0603; Voltage Rating: 75V; Power Rating: 100mW; Temperature Coefficient: 50ppm/°C; Max Power Dissipation: 125mW; Resistance: 10kR; Case/Package: 0603; Military Standard: Not; Min Operating Temperature: -55°C; Width: 0.8mm; Package Quantity: 1; Max Operating Temperature: 125°C; Tolerance: 1%; Depth: 0.85mm; Radiation Hardening: No; Mount: Surface Mount; Composition: Thin Film; Contact Plating: Tin; Lead Free: Lead Free; Case Code (Imperial): 0603; Number of Terminations: 2; Voltage Rating (DC): 75V; Length: 1.55mm; Packaging: Tape and Reel; Height: 0.022inch; Case Code (Metric): 1608
U1 = CMP-04918-000155-1: IC REG BUCK ADJ 3A TSOT23-6; Quiescent Current: 190uA; Output Voltage: 7V; Min Input Voltage: 4.5V; Output Configuration: Positive; Number of Outputs: 1; Switching Frequency: 650kHz; Synchronous Rectifier: Yes; Min Output Voltage: 760mV; Output Type: Adjustable; Operating Supply Voltage: 17V; Max Operating Temperature: 125°C; Lead Free: Lead Free; Packaging: Tape and Reel; Radiation Hardening: No; Mount: Surface Mount; Contact Plating: Tin; Output Current: 3A; Max Output Voltage: 7V; Min Operating Temperature: -40°C; Case/Package: SOT-23-6; Max Output Current: 3A; Max Input Voltage: 17V
U2 = CMP-04918-000714-1: 3.8-V TO 30-V INPUT, 2-A, 200-KH